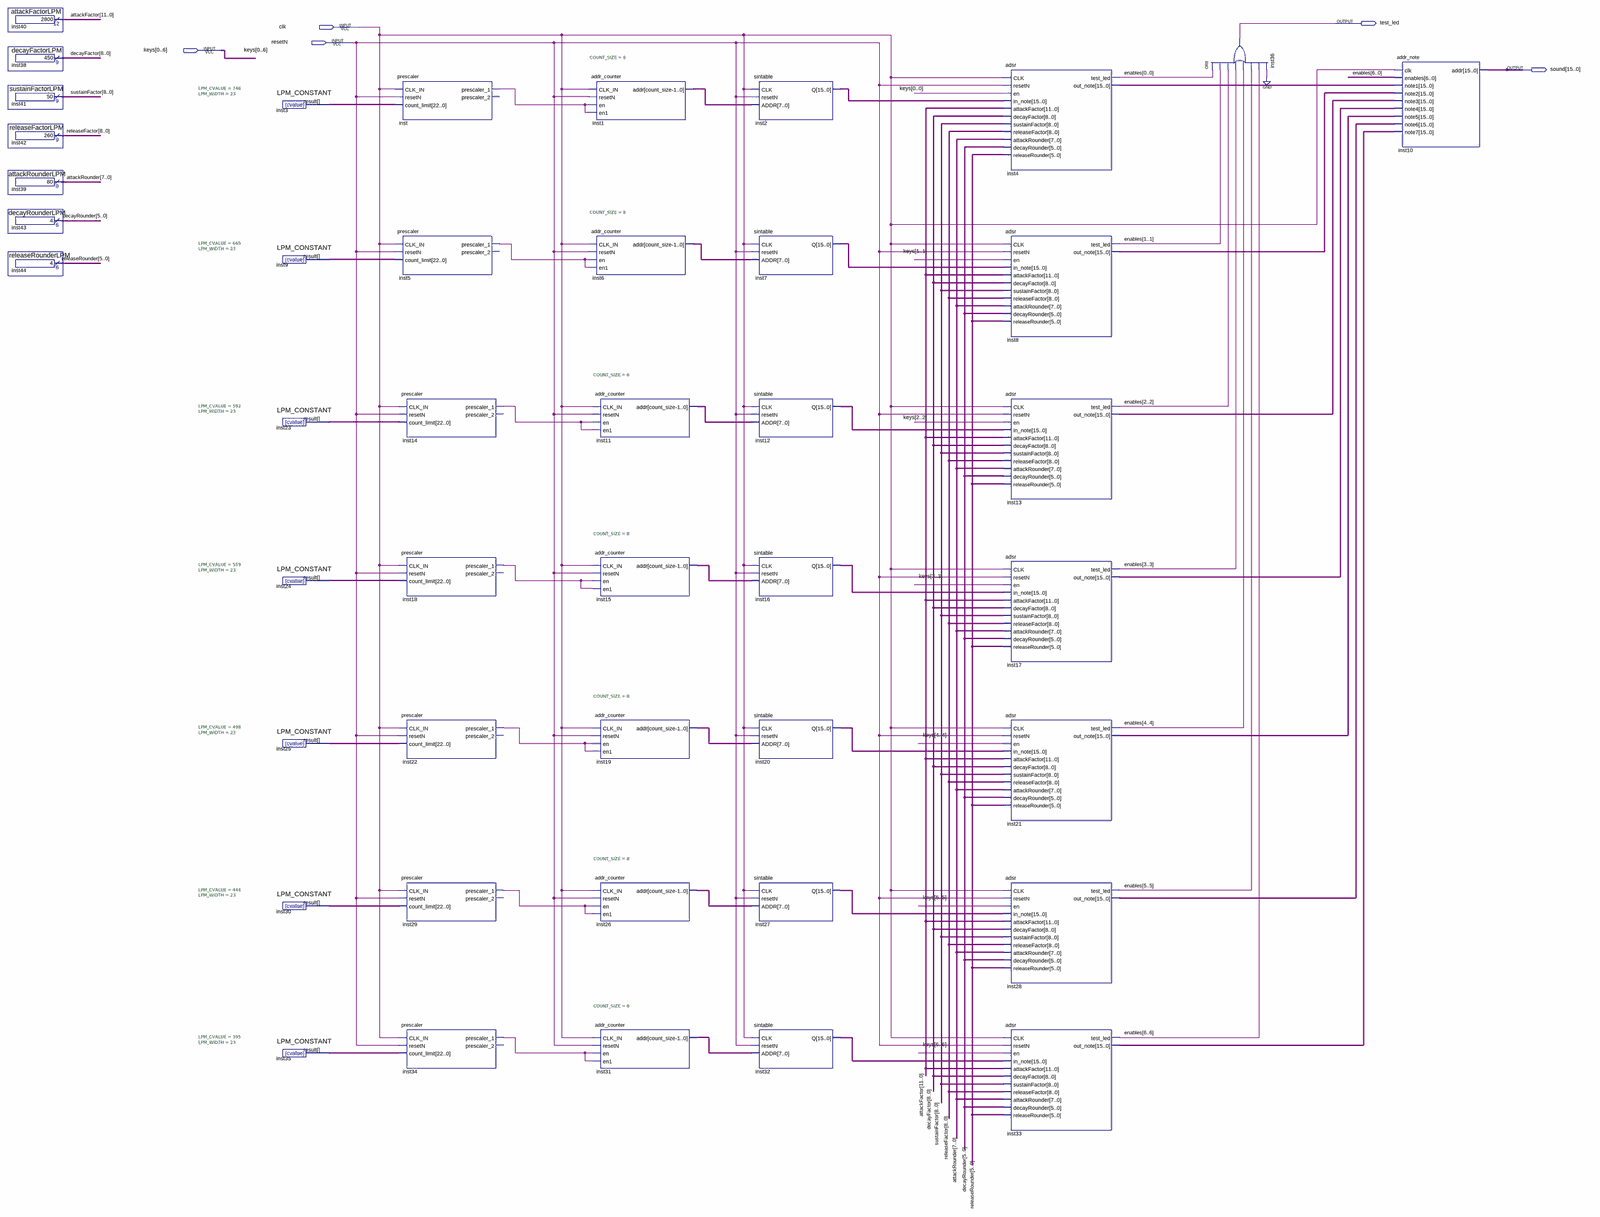
[diagram p0: schematic sheet, whole]
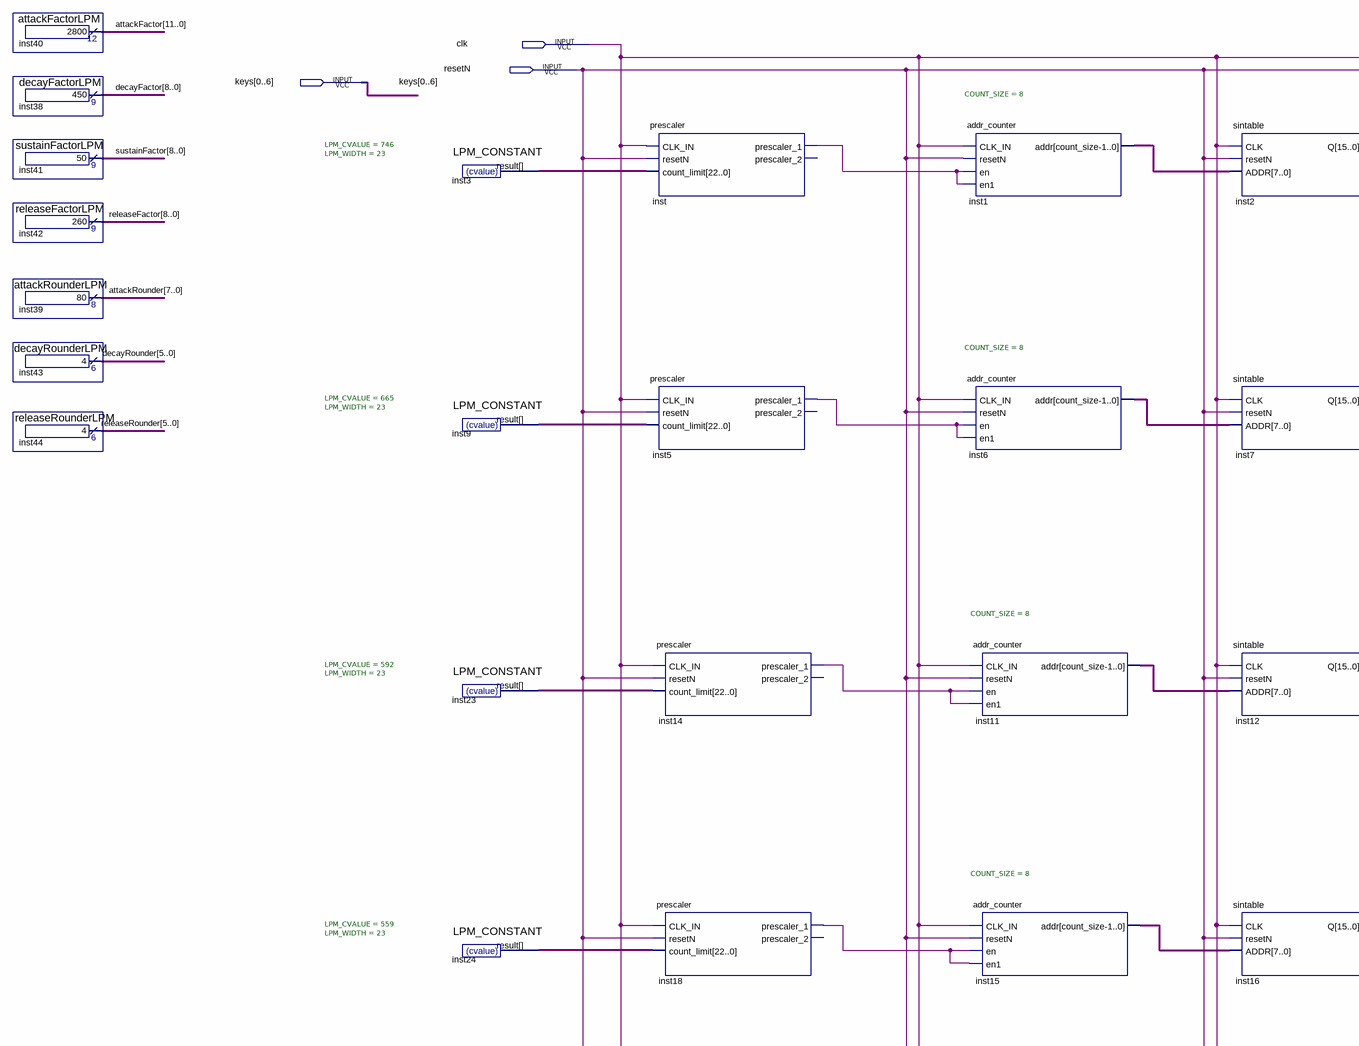
[diagram p1: schematic sheet, upper left part]
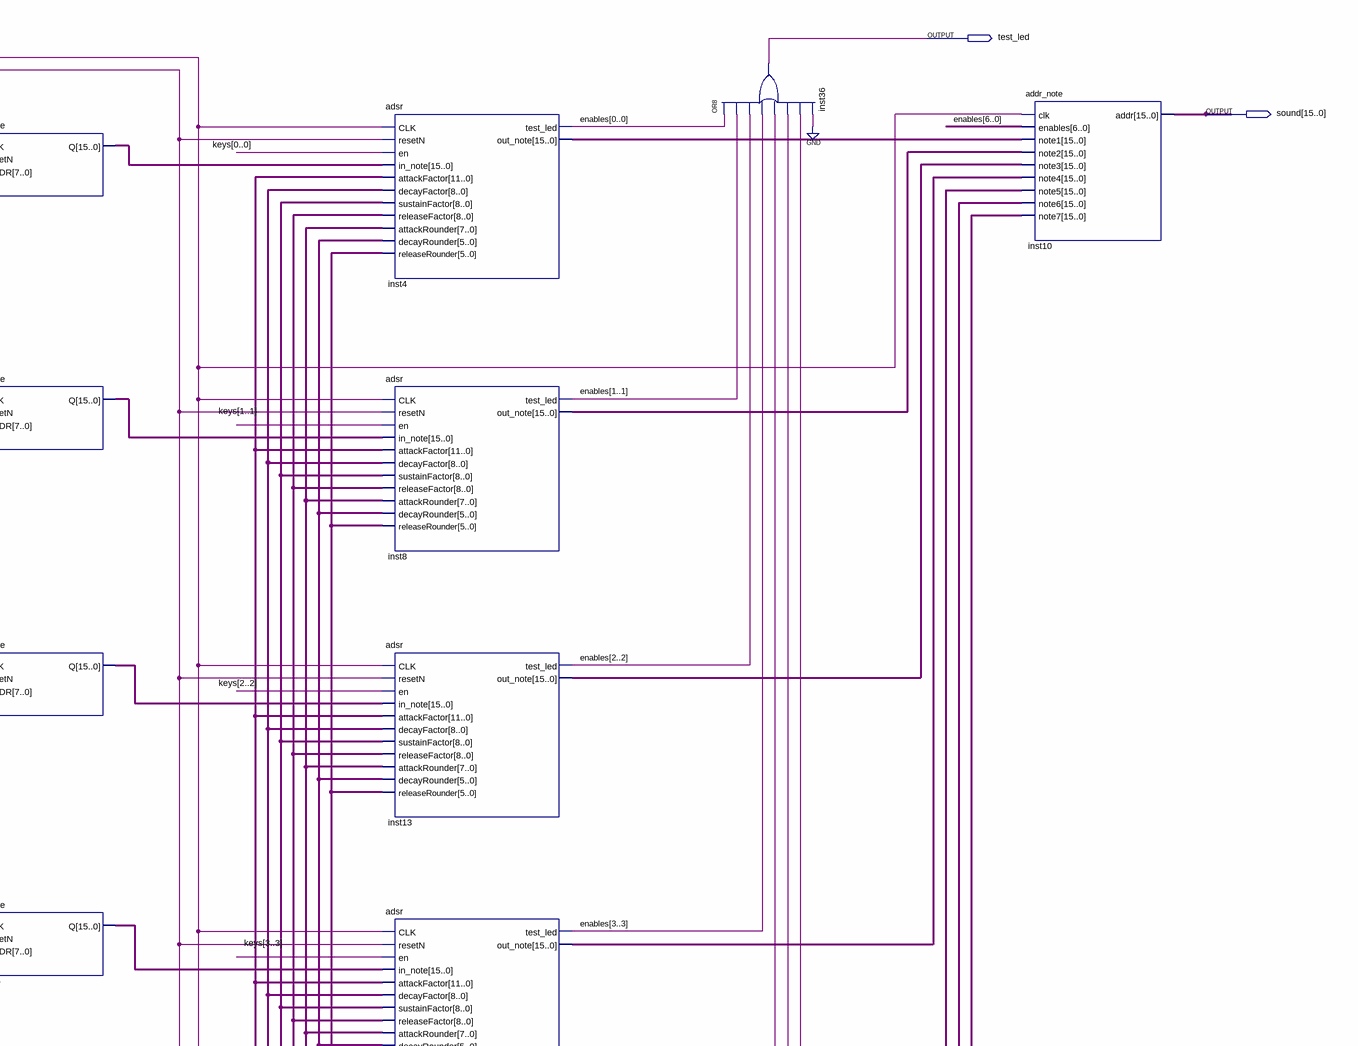
[diagram p2: schematic sheet, upper right part]
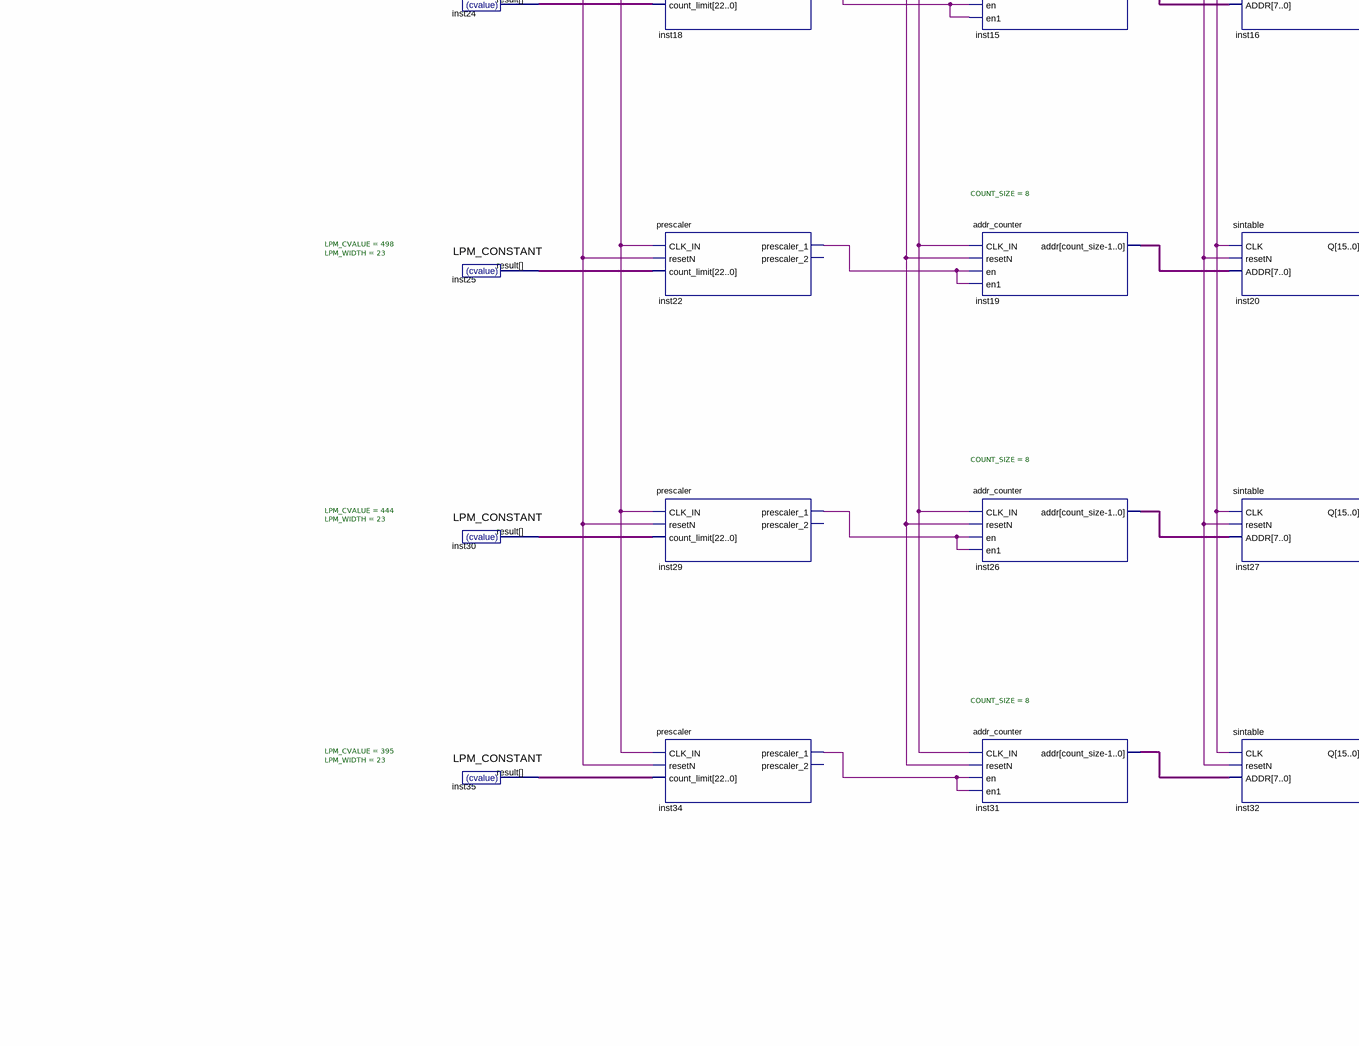
[diagram p3: schematic sheet, lower left part]
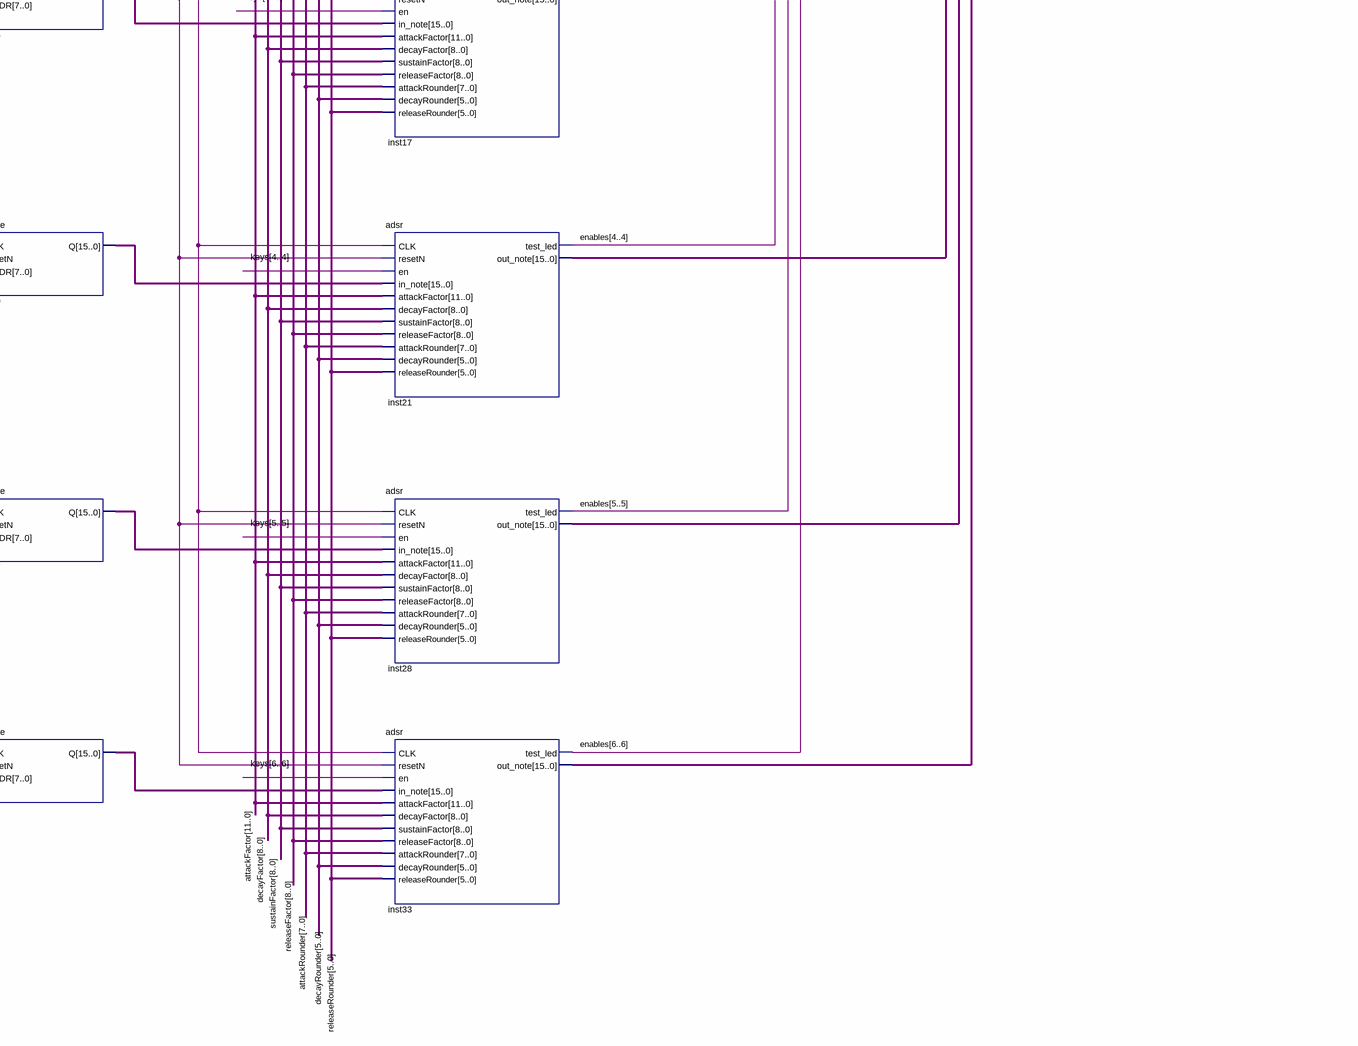
[diagram p4: schematic sheet, lower right part]
// Quartus schematic sound_manager.bdf as structural Verilog: 44 symbols, 5 pins
module sound_manager (
  input  clk,
  input  resetN,
  input  [0:6] keys,
  output test_led,
  output [15:0] sound
);

  wire inst5_prescaler_1, inst14_prescaler_1, inst18_prescaler_1, inst22_prescaler_1, inst29_prescaler_1,
       inst34_prescaler_1, inst_prescaler_1;
  wire [5:0] decayRounder, releaseRounder;
  wire [6:0] enables;
  wire [7:0] attackRounder, inst1_addr, inst6_addr, inst11_addr, inst15_addr, inst19_addr, inst26_addr,
       inst31_addr;
  wire [8:0] decayFactor, releaseFactor, sustainFactor;
  wire [11:0] attackFactor;
  wire [15:0] inst2_q, inst4_out_note, inst7_q, inst8_out_note, inst12_q, inst13_out_note, inst16_q,
       inst17_out_note, inst20_q, inst21_out_note, inst27_q, inst28_out_note, inst32_q, inst33_out_note;
  wire [22:0] inst3_result, inst9_result, inst23_result, inst24_result, inst25_result, inst30_result,
       inst35_result;

  attackFactorLPM inst40 (.result(attackFactor));
  decayFactorLPM inst38 (.result(decayFactor));
  sustainFactorLPM inst41 (.result(sustainFactor));
  releaseFactorLPM inst42 (.result(releaseFactor));
  attackRounderLPM inst39 (.result(attackRounder));
  decayRounderLPM inst43 (.result(decayRounder));
  releaseRounderLPM inst44 (.result(releaseRounder));
  LPM_CONSTANT #(.LPM_CVALUE(746), .LPM_WIDTH(23)) inst3 (.result(inst3_result));
  LPM_CONSTANT #(.LPM_CVALUE(665), .LPM_WIDTH(23)) inst9 (.result(inst9_result));
  LPM_CONSTANT #(.LPM_CVALUE(592), .LPM_WIDTH(23)) inst23 (.result(inst23_result));
  LPM_CONSTANT #(.LPM_CVALUE(559), .LPM_WIDTH(23)) inst24 (.result(inst24_result));
  LPM_CONSTANT #(.LPM_CVALUE(498), .LPM_WIDTH(23)) inst25 (.result(inst25_result));
  LPM_CONSTANT #(.LPM_CVALUE(444), .LPM_WIDTH(23)) inst30 (.result(inst30_result));
  LPM_CONSTANT #(.LPM_CVALUE(395), .LPM_WIDTH(23)) inst35 (.result(inst35_result));
  prescaler inst (
    .CLK_IN(clk), .resetN(resetN), .count_limit(inst3_result), .prescaler_1(inst_prescaler_1));  // open: prescaler_2
  prescaler inst5 (
    .CLK_IN(clk), .resetN(resetN), .count_limit(inst9_result), .prescaler_1(inst5_prescaler_1));  // open: prescaler_2
  prescaler inst14 (
    .CLK_IN(clk), .resetN(resetN), .count_limit(inst23_result), .prescaler_1(inst14_prescaler_1));  // open: prescaler_2
  prescaler inst18 (
    .CLK_IN(clk), .resetN(resetN), .count_limit(inst24_result), .prescaler_1(inst18_prescaler_1));  // open: prescaler_2
  prescaler inst22 (
    .CLK_IN(clk), .resetN(resetN), .count_limit(inst25_result), .prescaler_1(inst22_prescaler_1));  // open: prescaler_2
  prescaler inst29 (
    .CLK_IN(clk), .resetN(resetN), .count_limit(inst30_result), .prescaler_1(inst29_prescaler_1));  // open: prescaler_2
  prescaler inst34 (
    .CLK_IN(clk), .resetN(resetN), .count_limit(inst35_result), .prescaler_1(inst34_prescaler_1));  // open: prescaler_2
  addr_counter #(.COUNT_SIZE(8)) inst1 (
    .CLK_IN(clk), .resetN(resetN), .en(inst_prescaler_1), .en1(inst_prescaler_1), .addr(inst1_addr));
  addr_counter #(.COUNT_SIZE(8)) inst6 (
    .CLK_IN(clk), .resetN(resetN), .en(inst5_prescaler_1), .en1(inst5_prescaler_1), .addr(inst6_addr));
  addr_counter #(.COUNT_SIZE(8)) inst11 (
    .CLK_IN(clk), .resetN(resetN), .en(inst14_prescaler_1), .en1(inst14_prescaler_1), .addr(inst11_addr));
  addr_counter #(.COUNT_SIZE(8)) inst15 (
    .CLK_IN(clk), .resetN(resetN), .en(inst18_prescaler_1), .en1(inst18_prescaler_1), .addr(inst15_addr));
  addr_counter #(.COUNT_SIZE(8)) inst19 (
    .CLK_IN(clk), .resetN(resetN), .en(inst22_prescaler_1), .en1(inst22_prescaler_1), .addr(inst19_addr));
  addr_counter #(.COUNT_SIZE(8)) inst26 (
    .CLK_IN(clk), .resetN(resetN), .en(inst29_prescaler_1), .en1(inst29_prescaler_1), .addr(inst26_addr));
  addr_counter #(.COUNT_SIZE(8)) inst31 (
    .CLK_IN(clk), .resetN(resetN), .en(inst34_prescaler_1), .en1(inst34_prescaler_1), .addr(inst31_addr));
  sintable inst2 (.CLK(clk), .resetN(resetN), .ADDR(inst1_addr), .Q(inst2_q));
  sintable inst7 (.CLK(clk), .resetN(resetN), .ADDR(inst6_addr), .Q(inst7_q));
  sintable inst12 (.CLK(clk), .resetN(resetN), .ADDR(inst11_addr), .Q(inst12_q));
  sintable inst16 (.CLK(clk), .resetN(resetN), .ADDR(inst15_addr), .Q(inst16_q));
  sintable inst20 (.CLK(clk), .resetN(resetN), .ADDR(inst19_addr), .Q(inst20_q));
  sintable inst27 (.CLK(clk), .resetN(resetN), .ADDR(inst26_addr), .Q(inst27_q));
  sintable inst32 (.CLK(clk), .resetN(resetN), .ADDR(inst31_addr), .Q(inst32_q));
  adsr inst4 (
    .CLK(clk), .resetN(resetN), .en(keys[0]), .in_note(inst2_q), .attackFactor(attackFactor),
    .decayFactor(decayFactor), .sustainFactor(sustainFactor), .releaseFactor(releaseFactor),
    .attackRounder(attackRounder), .decayRounder(decayRounder), .releaseRounder(releaseRounder),
    .test_led(enables[0]), .out_note(inst4_out_note));
  adsr inst8 (
    .CLK(clk), .resetN(resetN), .en(keys[1]), .in_note(inst7_q), .attackFactor(attackFactor),
    .decayFactor(decayFactor), .sustainFactor(sustainFactor), .releaseFactor(releaseFactor),
    .attackRounder(attackRounder), .decayRounder(decayRounder), .releaseRounder(releaseRounder),
    .test_led(enables[1]), .out_note(inst8_out_note));
  adsr inst13 (
    .CLK(clk), .resetN(resetN), .en(keys[2]), .in_note(inst12_q), .attackFactor(attackFactor),
    .decayFactor(decayFactor), .sustainFactor(sustainFactor), .releaseFactor(releaseFactor),
    .attackRounder(attackRounder), .decayRounder(decayRounder), .releaseRounder(releaseRounder),
    .test_led(enables[2]), .out_note(inst13_out_note));
  adsr inst17 (
    .CLK(clk), .resetN(resetN), .en(keys[3]), .in_note(inst16_q), .attackFactor(attackFactor),
    .decayFactor(decayFactor), .sustainFactor(sustainFactor), .releaseFactor(releaseFactor),
    .attackRounder(attackRounder), .decayRounder(decayRounder), .releaseRounder(releaseRounder),
    .test_led(enables[3]), .out_note(inst17_out_note));
  adsr inst21 (
    .CLK(clk), .resetN(resetN), .en(keys[4]), .in_note(inst20_q), .attackFactor(attackFactor),
    .decayFactor(decayFactor), .sustainFactor(sustainFactor), .releaseFactor(releaseFactor),
    .attackRounder(attackRounder), .decayRounder(decayRounder), .releaseRounder(releaseRounder),
    .test_led(enables[4]), .out_note(inst21_out_note));
  adsr inst28 (
    .CLK(clk), .resetN(resetN), .en(keys[5]), .in_note(inst27_q), .attackFactor(attackFactor),
    .decayFactor(decayFactor), .sustainFactor(sustainFactor), .releaseFactor(releaseFactor),
    .attackRounder(attackRounder), .decayRounder(decayRounder), .releaseRounder(releaseRounder),
    .test_led(enables[5]), .out_note(inst28_out_note));
  adsr inst33 (
    .CLK(clk), .resetN(resetN), .en(keys[6]), .in_note(inst32_q), .attackFactor(attackFactor),
    .decayFactor(decayFactor), .sustainFactor(sustainFactor), .releaseFactor(releaseFactor),
    .attackRounder(attackRounder), .decayRounder(decayRounder), .releaseRounder(releaseRounder),
    .test_led(enables[6]), .out_note(inst33_out_note));
  or inst36 (test_led, enables[0], enables[1], enables[2], enables[3], enables[4], enables[5], enables[6], 1'b0);
  addr_note inst10 (
    .clk(clk), .enables(enables), .note1(inst4_out_note), .note2(inst8_out_note), .note3(inst13_out_note),
    .note4(inst17_out_note), .note5(inst21_out_note), .note6(inst28_out_note), .note7(inst33_out_note),
    .addr(sound));
endmodule
